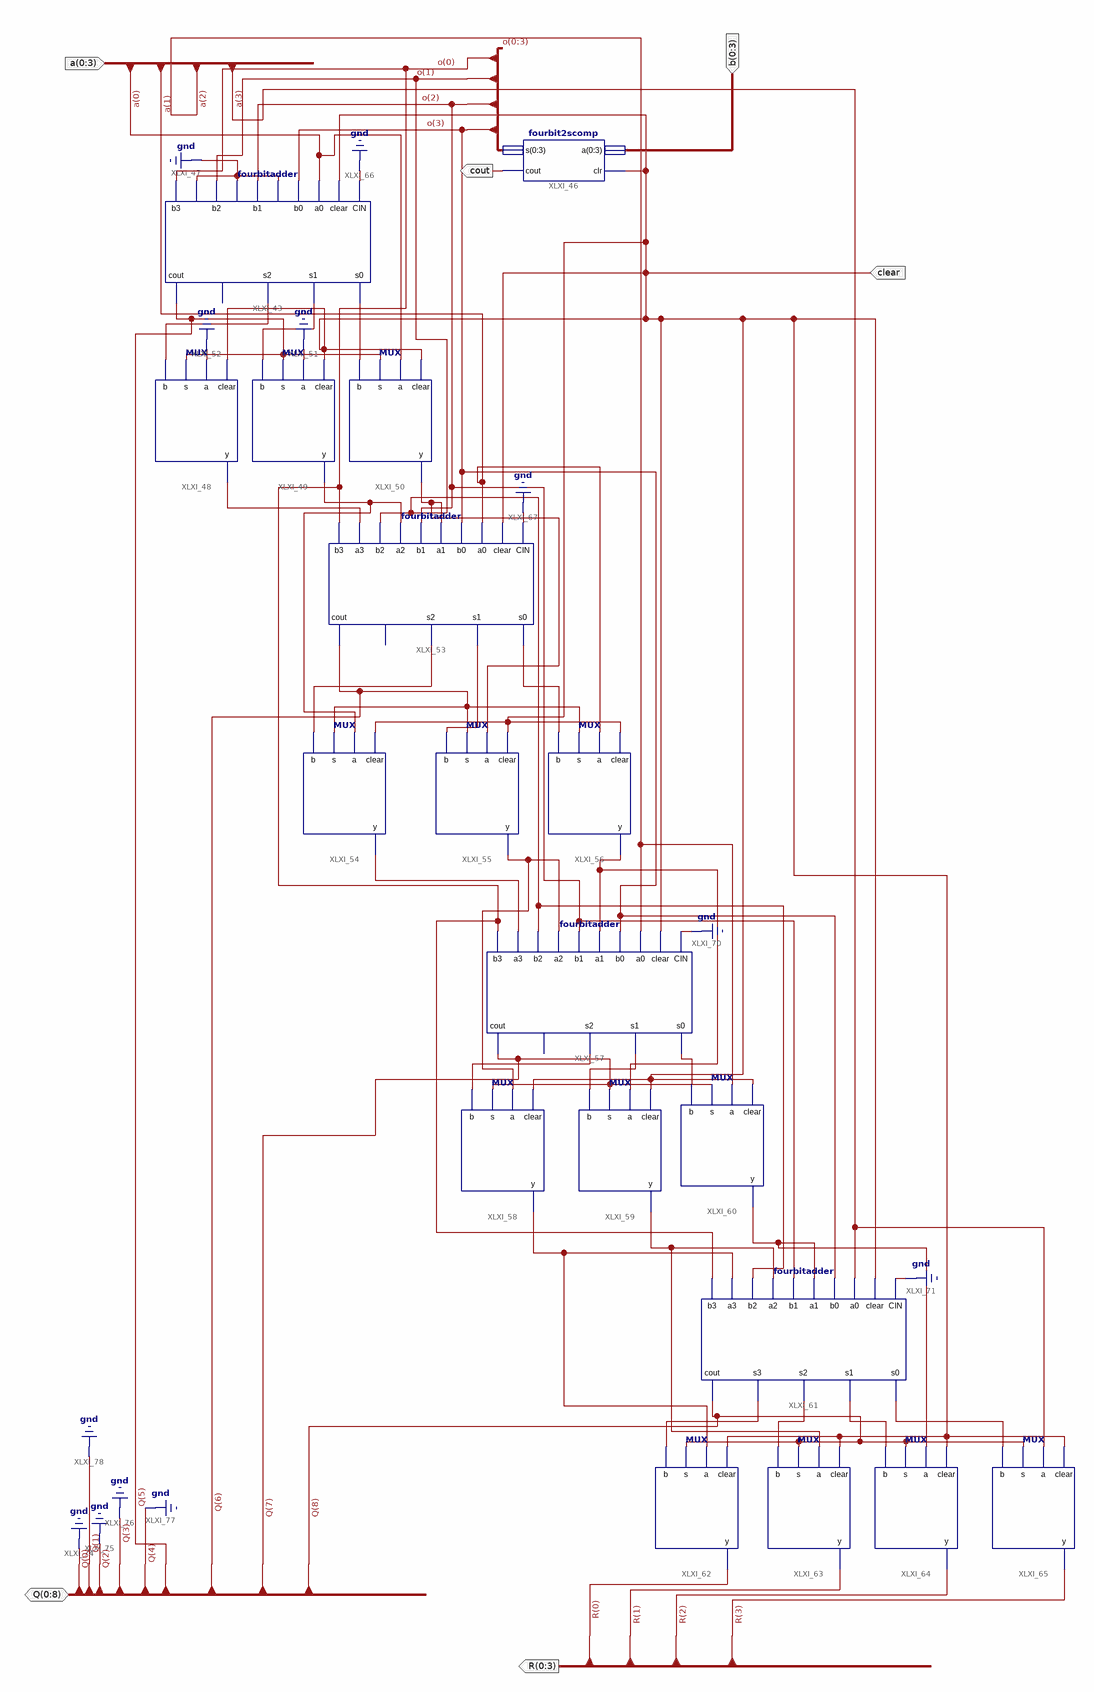
[diagram p0: schematic sheet 1]
// Xilinx ISE schematic divider.sch (artix7) as structural Verilog: 18 symbols, 6 ports
module divider (
  input  [0:3] a,
  input  [0:3] b,
  input  clear,
  inout  [0:8] Q,
  output [0:3] R,
  output cout
);

  wire XLXN_145, XLXN_146, XLXN_147, XLXN_154, XLXN_156, XLXN_162, XLXN_164, XLXN_165, XLXN_166, XLXN_170,
       XLXN_172, XLXN_174, XLXN_177, XLXN_178, XLXN_184, XLXN_186, XLXN_187, XLXN_188, XLXN_193, XLXN_194,
       XLXN_195, XLXN_196;
  wire [3:0] o;

  fourbitadder XLXI_43 (
    .CIN(1'b0), .clear(clear), .a0(a[0]), .b0(o[3]), .a1(1'b0), .b1(o[2]), .a2(1'b0), .b2(o[1]), .a3(1'b0),
    .b3(o[0]), .s0(XLXN_145), .s1(XLXN_146), .s2(XLXN_147), .cout(Q[5]));  // open: s3
  fourbit2scomp XLXI_46 (.a(b), .clr(clear), .s({o[0], o[1], o[2], o[3]}), .cout(cout));
  MUX XLXI_48 (.clear(clear), .a(1'b0), .s(Q[5]), .b(XLXN_147), .y(XLXN_156));
  MUX XLXI_49 (.clear(clear), .a(1'b0), .s(Q[5]), .b(XLXN_146), .y(XLXN_162));
  MUX XLXI_50 (.clear(clear), .a(a[0]), .s(Q[5]), .b(XLXN_145), .y(XLXN_154));
  fourbitadder XLXI_53 (
    .CIN(1'b0), .clear(clear), .a0(a[1]), .b0(o[3]), .a1(XLXN_154), .b1(o[2]), .a2(XLXN_162), .b2(o[1]),
    .a3(XLXN_156), .b3(o[0]), .s0(XLXN_164), .s1(XLXN_165), .s2(XLXN_166), .cout(Q[6]));  // open: s3
  MUX XLXI_54 (.clear(clear), .a(XLXN_162), .s(Q[6]), .b(XLXN_166), .y(XLXN_172));
  MUX XLXI_55 (.clear(clear), .a(XLXN_154), .s(Q[6]), .b(XLXN_165), .y(XLXN_184));
  MUX XLXI_56 (.clear(clear), .a(a[1]), .s(Q[6]), .b(XLXN_164), .y(XLXN_170));
  fourbitadder XLXI_57 (
    .CIN(1'b0), .clear(clear), .a0(a[2]), .b0(o[3]), .a1(XLXN_170), .b1(o[2]), .a2(XLXN_184), .b2(o[1]),
    .a3(XLXN_172), .b3(o[0]), .s0(XLXN_174), .s1(XLXN_177), .s2(XLXN_178), .cout(Q[7]));  // open: s3
  MUX XLXI_58 (.clear(clear), .a(XLXN_184), .s(Q[7]), .b(XLXN_178), .y(XLXN_188));
  MUX XLXI_59 (.clear(clear), .a(XLXN_170), .s(Q[7]), .b(XLXN_177), .y(XLXN_187));
  MUX XLXI_60 (.clear(clear), .a(a[2]), .s(Q[7]), .b(XLXN_174), .y(XLXN_186));
  fourbitadder XLXI_61 (
    .CIN(1'b0), .clear(clear), .a0(a[3]), .b0(o[3]), .a1(XLXN_186), .b1(o[2]), .a2(XLXN_187), .b2(o[1]),
    .a3(XLXN_188), .b3(o[0]), .s0(XLXN_193), .s1(XLXN_194), .s2(XLXN_195), .s3(XLXN_196), .cout(Q[8]));
  MUX XLXI_62 (.clear(clear), .a(XLXN_188), .s(Q[8]), .b(XLXN_196), .y(R[0]));
  MUX XLXI_63 (.clear(clear), .a(XLXN_187), .s(Q[8]), .b(XLXN_195), .y(R[1]));
  MUX XLXI_64 (.clear(clear), .a(XLXN_186), .s(Q[8]), .b(XLXN_194), .y(R[2]));
  MUX XLXI_65 (.clear(clear), .a(a[3]), .s(Q[8]), .b(XLXN_193), .y(R[3]));
  // also tied to GND on the sheet: Q[0:4]
endmodule
